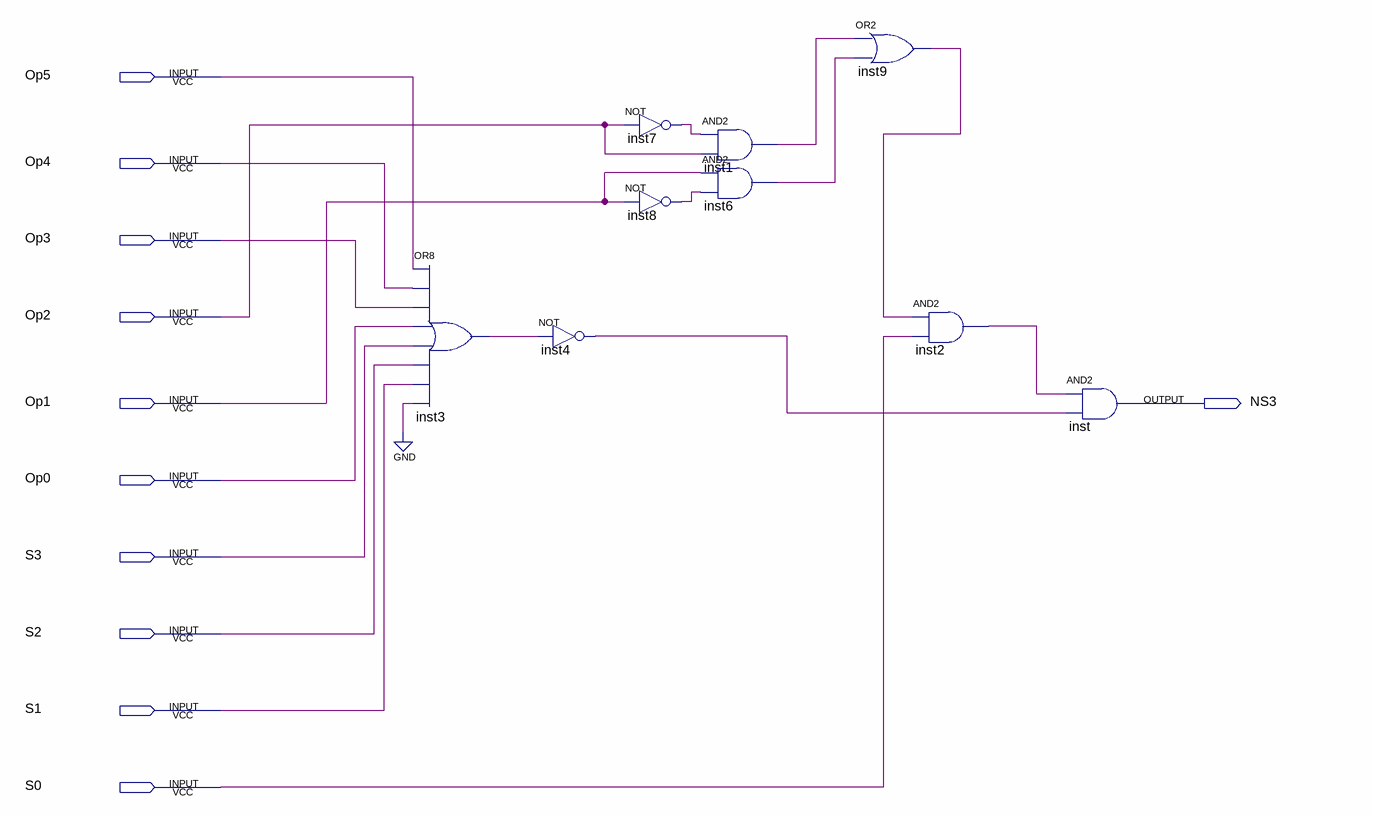
[diagram p0: schematic sheet]
// Quartus schematic NS3.bdf as structural Verilog: 9 symbols, 11 pins
module NS3 (
  input  Op5,
  input  Op4,
  input  Op3,
  input  Op2,
  input  Op1,
  input  Op0,
  input  S3,
  input  S2,
  input  S1,
  input  S0,
  output NS3
);

  wire inst1_out, inst2_out, inst3_out, inst4_out, inst6_out, inst7_out, inst8_out, inst9_out;

  or inst3 (inst3_out, Op5, Op4, Op3, Op0, S3, S2, S1, 1'b0);
  not inst4 (inst4_out, inst3_out);
  not inst7 (inst7_out, Op2);
  not inst8 (inst8_out, Op1);
  and inst1 (inst1_out, inst7_out, Op2);
  and inst6 (inst6_out, Op1, inst8_out);
  or inst9 (inst9_out, inst1_out, inst6_out);
  and inst2 (inst2_out, inst9_out, S0);
  and inst (NS3, inst2_out, inst4_out);
endmodule
